# Altium schematic sheet Sheet1.SchDoc
size 840 x 594 mm; ЕСКД_Децимальний_номер: ДК41.468224.001; ЕСКД_Назва_пристрою: Контролер управління; ЕСКД_Назва_схеми_1: Схема електрична; ЕСКД_Назва_схеми_2: принципова; ЕСКД_Розробив: Білаш Б.О.; ЕСКД_Перевірив: Адаменко І.О.; ЕСКД_Затвердив: Антонюк О.І.; ЕСКД_Листів: 1; PageSetup: Record=PageOptions|CenterHorizontal=True|CenterVertical=True|PrintScale=0.98|XCorrection=1.00|YCorrection=1.00|PrintKind=1|BorderSize=5000000|LeftOffset=0|BottomOffset=0|Orientation=2|PaperLength=1000|PaperWidth=1000|Scale=100|PaperSource=15|PrintQuality=1200|MediaType=1|DitherType=10|PrintScaleMode=1|PaperKind=A3|PaperIndex=8; ЕСКД_Організація_1: КПІ ім. Ігоря Сікорського; ЕСКД_Організація_2: ФЕЛ, КЕОА, ДК-41; ЕСКД_Маштаб: 1:1; ЕСКД_Тема_1: Блок керування двигуном; ЕСКД_Тема_2: по положенню; ЕСКД_Децимальний_номер_Е3: ДК41.468224.001 Е3
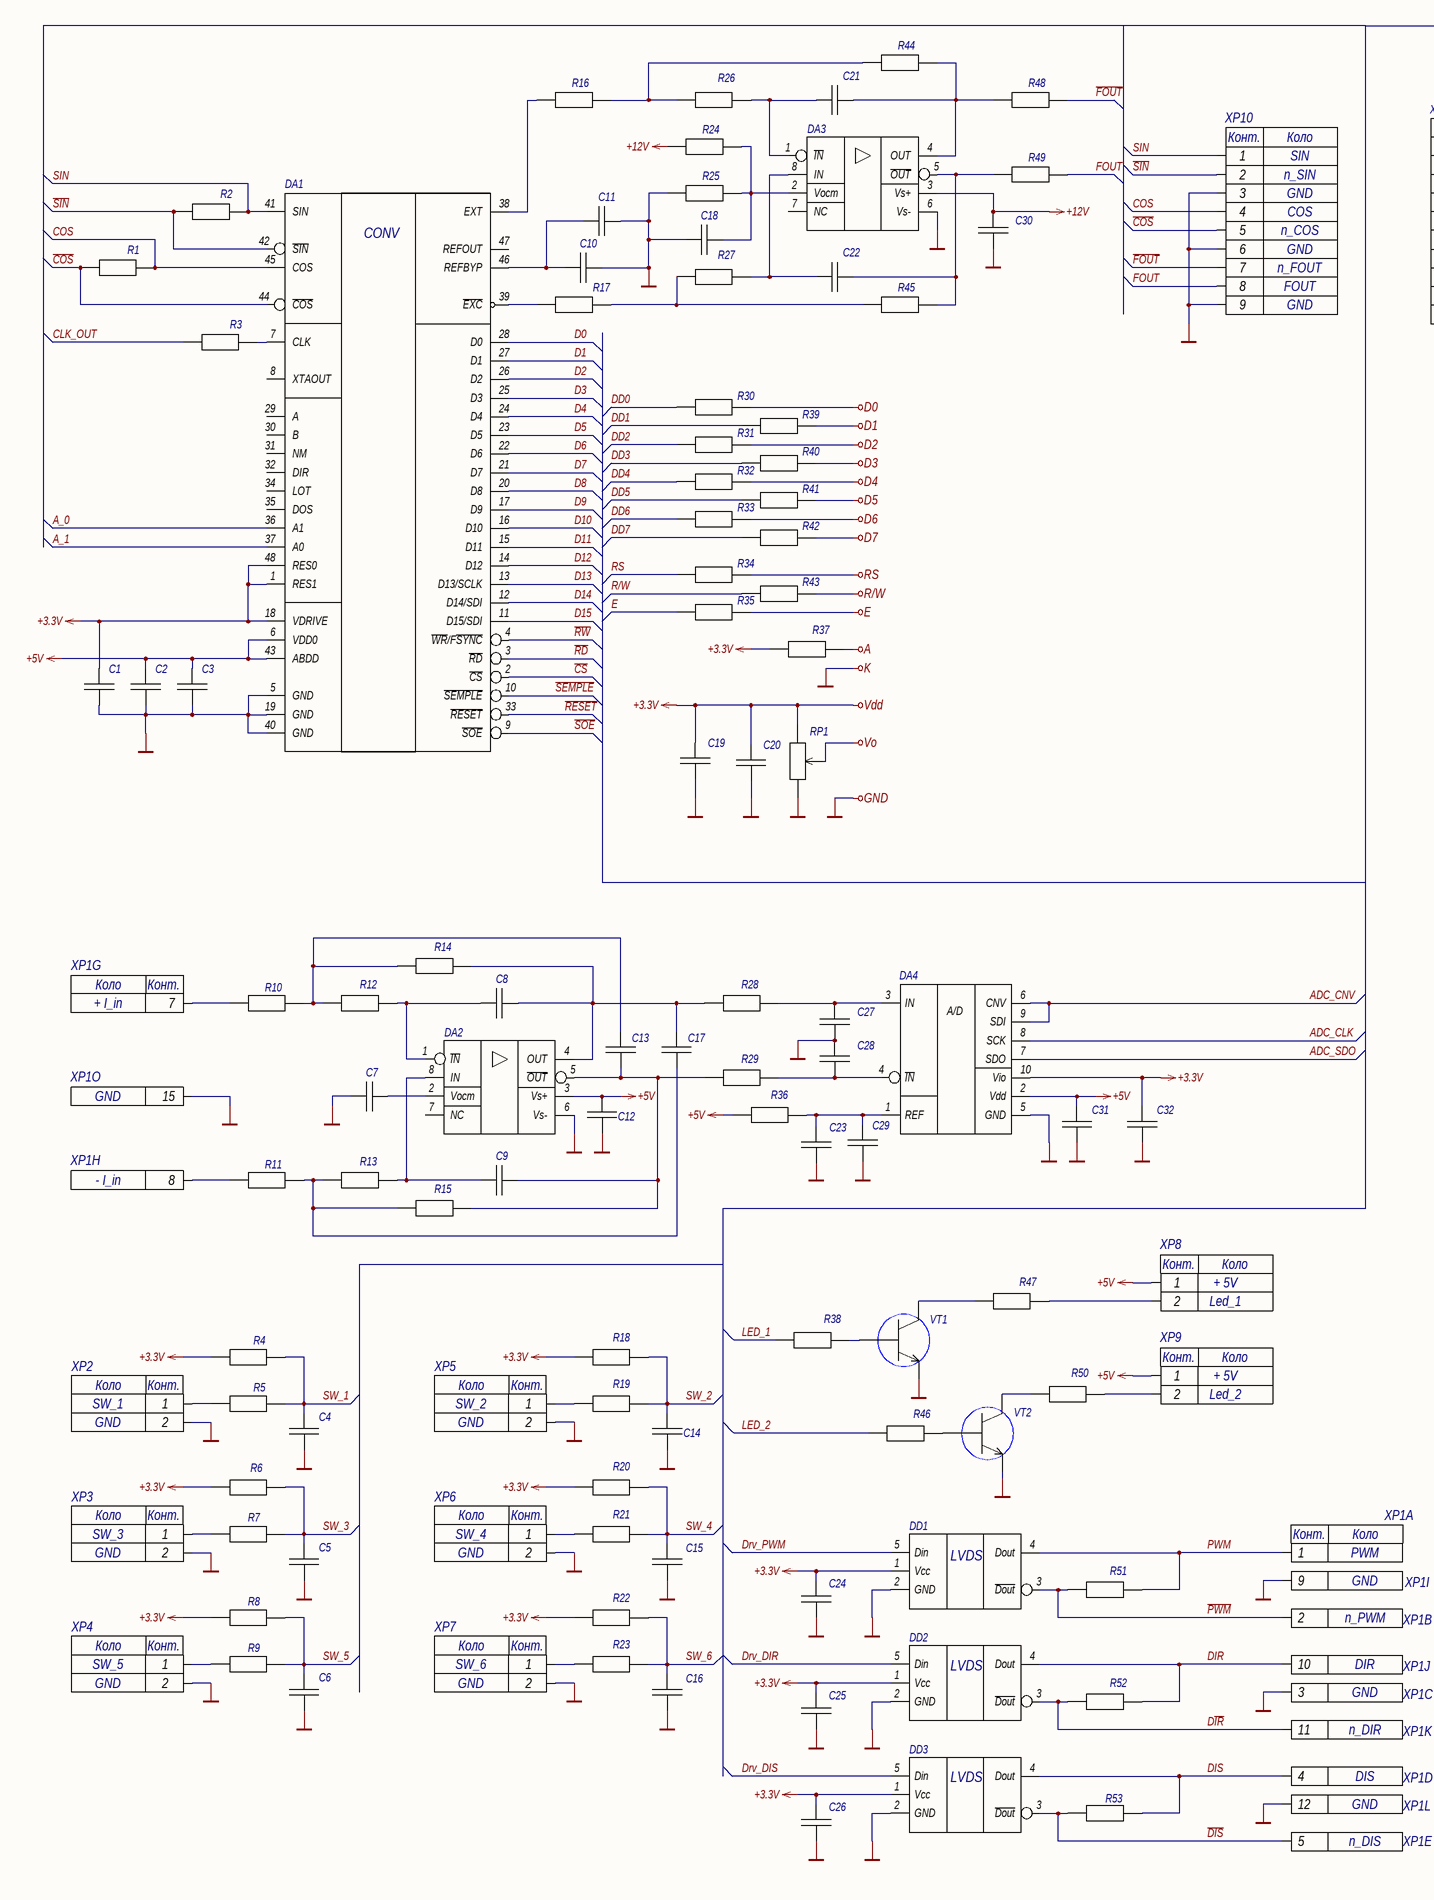
[diagram p0: Sheet1.SchDoc, left]
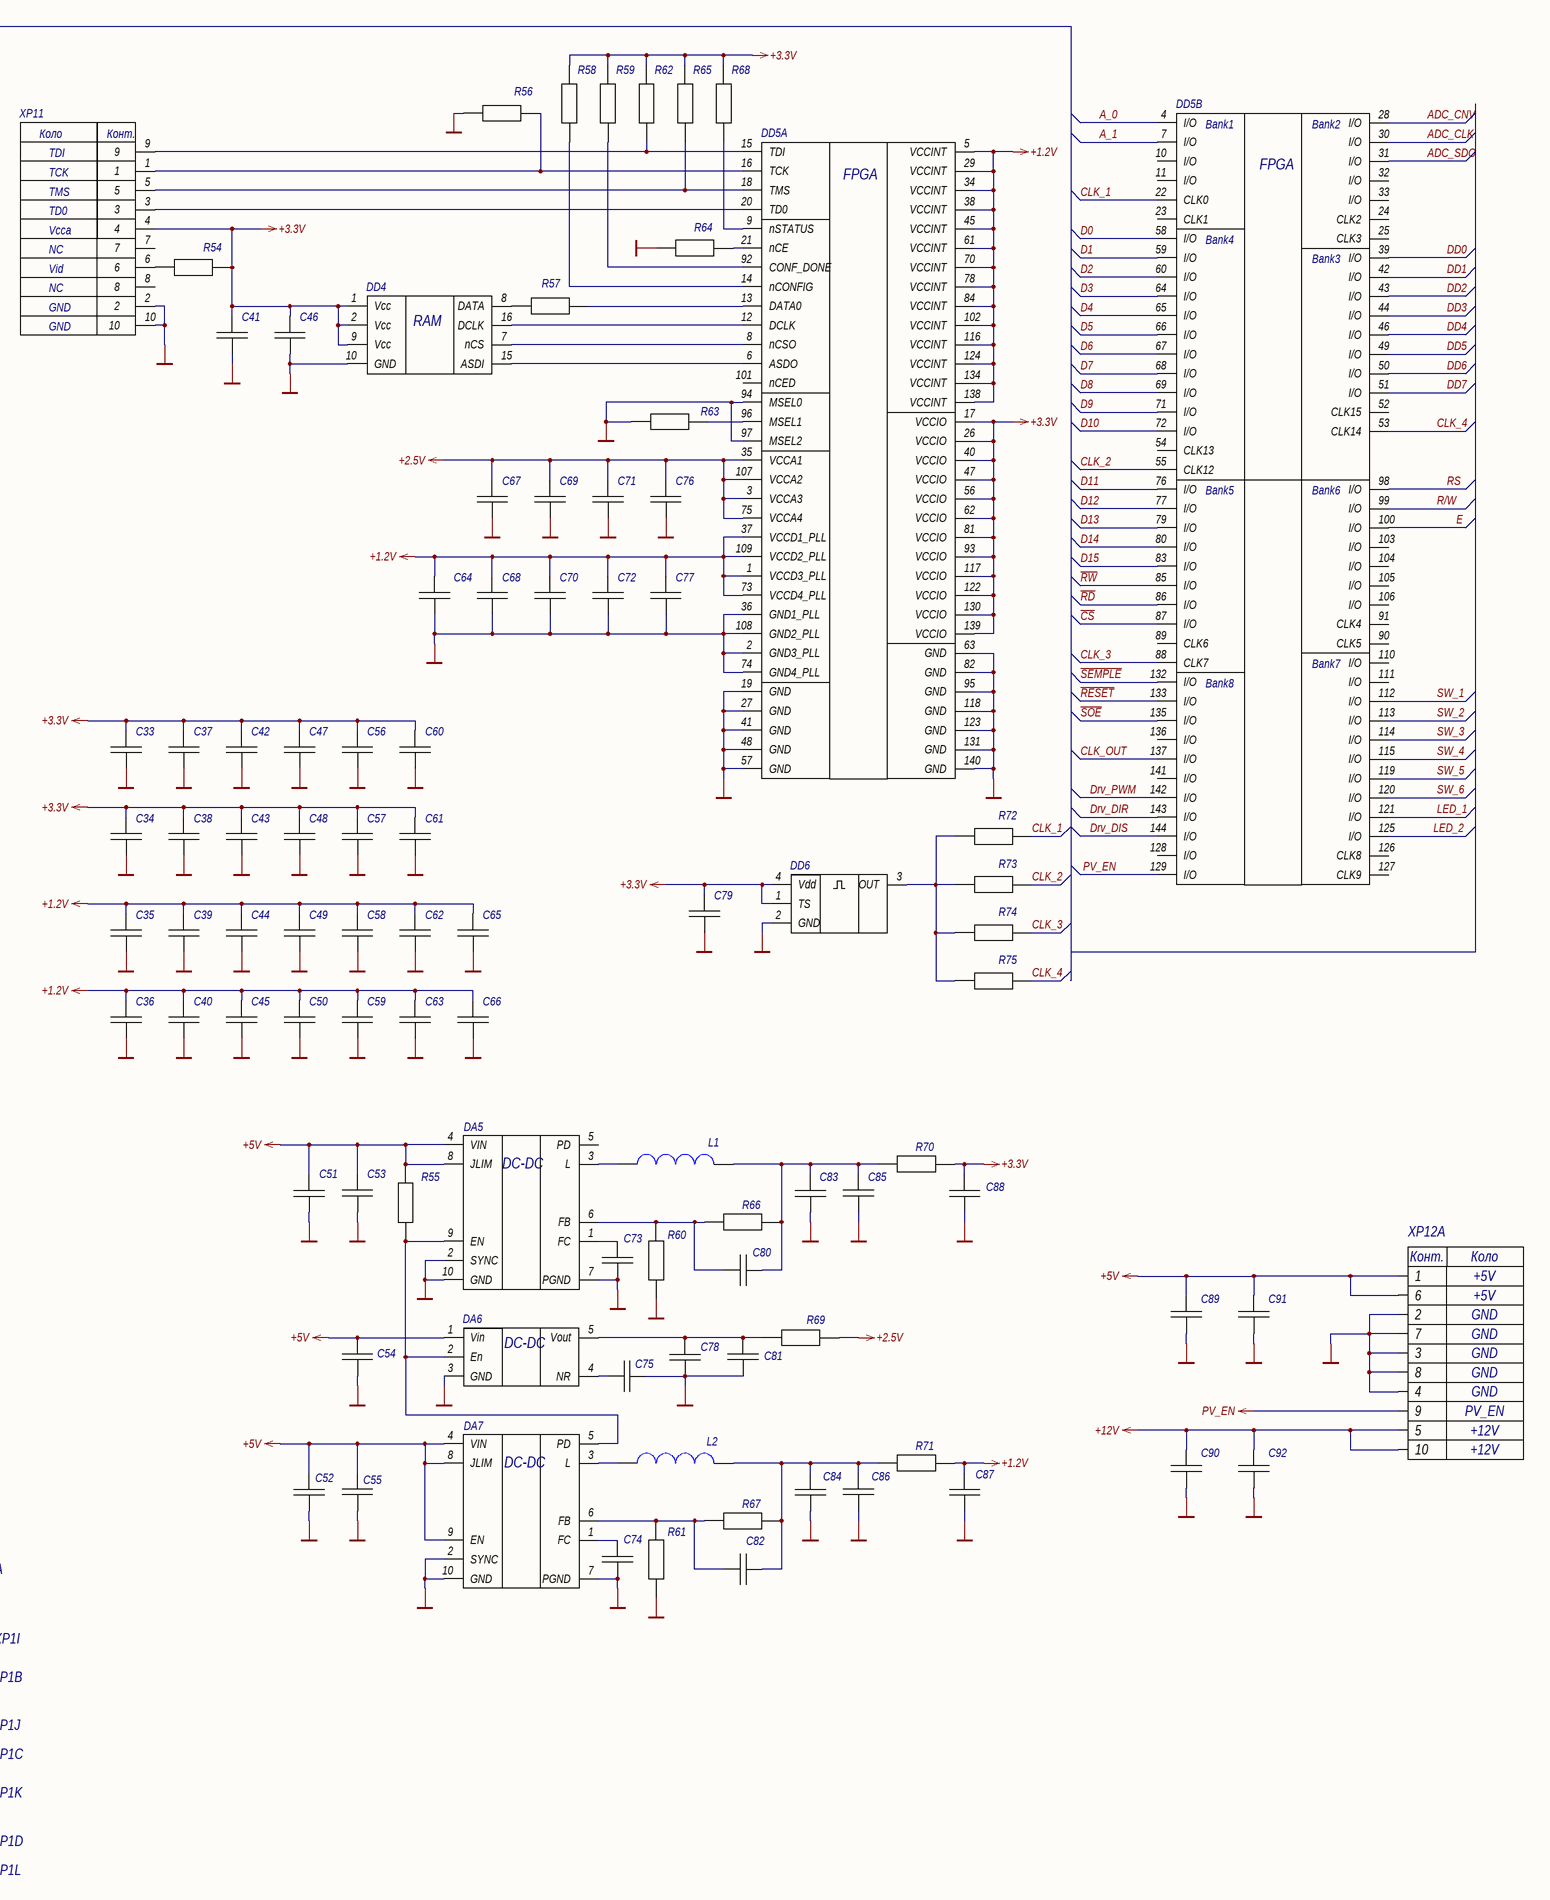
[diagram p1: Sheet1.SchDoc, right]

## Parts
(Parts that share a designator on the sheet are numbered #1, #2 ... from top to bottom, then left to right.)
?#1  (no value)
?#2  plata_1  (value not drawn)
?#3  plata  (value not drawn)
C1  0,1 мкФ  [C_0603]  (value not drawn)
C2  0,1 мкФ  [C_0603]  (value not drawn)
C3  0,1 мкФ  [C_0603]  (value not drawn)
C4  0,1 мкФ  [C_0603]  (value not drawn)
C5  0,1 мкФ  [C_0603]  (value not drawn)
C6  0,1 мкФ  [C_0603]  (value not drawn)
C7  0,1 мкФ  [C_0603]  (value not drawn)
C8  68 пФ  [C_0603]  (value not drawn)
C9  68 пФ  [C_0603]  (value not drawn)
C10  10 мкФ  [C_1206]  (value not drawn)
C11  0,1 мкФ  [C_0603]  (value not drawn)
C12  0,1 мкФ  [C_0603]  (value not drawn)
C13  68 пФ  [C_0603]  (value not drawn)
C14  0,1 мкФ  [C_0603]  (value not drawn)
C15  0,1 мкФ  [C_0603]  (value not drawn)
C16  0,1 мкФ  [C_0603]  (value not drawn)
C17  68 пФ  [C_0603]  (value not drawn)
C18  0,1 мкФ  [C_0603]  (value not drawn)
C19  0,1 мкФ  [C_0603]  (value not drawn)
C20  10 мкФ  [C_1206]  (value not drawn)
C21  68 пФ  [C_0603]  (value not drawn)
C22  68 пФ  [C_0603]  (value not drawn)
C23  10 мкФ  [C_1206]  (value not drawn)
C24  0,1 мкФ  [C_0603]  (value not drawn)
C25  0,1 мкФ  [C_0603]  (value not drawn)
C26  0,1 мкФ  [C_0603]  (value not drawn)
C27  1,8 нФ  [C_0603]  (value not drawn)
C28  1,8 нФ  [C_0603]  (value not drawn)
C29  0,1 мкФ  [C_0603]  (value not drawn)
C30  0,1 мкФ  [C_0603]  (value not drawn)
C31  0,1 мкФ  [C_0603]  (value not drawn)
C32  0,1 мкФ  [C_0603]  (value not drawn)
C33  0,1 мкФ  [C_0603]  (value not drawn)
C34  0,1 мкФ  [C_0603]  (value not drawn)
C35  0,1 мкФ  [C_0603]  (value not drawn)
C36  0,1 мкФ  [C_0603]  (value not drawn)
C37  0,1 мкФ  [C_0603]  (value not drawn)
C38  0,1 мкФ  [C_0603]  (value not drawn)
C39  0,1 мкФ  [C_0603]  (value not drawn)
C40  0,1 мкФ  [C_0603]  (value not drawn)
C41  0,1 мкФ  [C_0603]  (value not drawn)
C42  0,1 мкФ  [C_0603]  (value not drawn)
C43  0,1 мкФ  [C_0603]  (value not drawn)
C44  0,1 мкФ  [C_0603]  (value not drawn)
C45  0,1 мкФ  [C_0603]  (value not drawn)
C46  0,1 мкФ  [C_0603]  (value not drawn)
C47  0,1 мкФ  [C_0603]  (value not drawn)
C48  0,1 мкФ  [C_0603]  (value not drawn)
C49  0,1 мкФ  [C_0603]  (value not drawn)
C50  0,1 мкФ  [C_0603]  (value not drawn)
C51  10 мкФ  [C_1206]  (value not drawn)
C52  10 мкФ  [C_1206]  (value not drawn)
C53  0,1 мкФ  [C_0603]  (value not drawn)
C54  0,1 мкФ  [C_0603]  (value not drawn)
C55  0,1 мкФ  [C_0603]  (value not drawn)
C56  0,1 мкФ  [C_0603]  (value not drawn)
C57  0,1 мкФ  [C_0603]  (value not drawn)
C58  0,1 мкФ  [C_0603]  (value not drawn)
C59  0,1 мкФ  [C_0603]  (value not drawn)
C60  0,1 мкФ  [C_0603]  (value not drawn)
C61  0,1 мкФ  [C_0603]  (value not drawn)
C62  0,1 мкФ  [C_0603]  (value not drawn)
C63  0,1 мкФ  [C_0603]  (value not drawn)
C64  0,1 мкФ  [C_0603]  (value not drawn)
C65  0,1 мкФ  [C_0603]  (value not drawn)
C66  0,1 мкФ  [C_0603]  (value not drawn)
C67  0,1 мкФ  [C_0603]  (value not drawn)
C68  0,1 мкФ  [C_0603]  (value not drawn)
C69  0,1 мкФ  [C_0603]  (value not drawn)
C70  0,1 мкФ  [C_0603]  (value not drawn)
C71  0,1 мкФ  [C_0603]  (value not drawn)
C72  0,1 мкФ  [C_0603]  (value not drawn)
C73  0,1 мкФ  [C_0603]  (value not drawn)
C74  0,1 мкФ  [C_0603]  (value not drawn)
C75  0,1 мкФ  [C_0603]  (value not drawn)
C76  0,1 мкФ  [C_0603]  (value not drawn)
C77  0,1 мкФ  [C_0603]  (value not drawn)
C78  10 мкФ  [C_1206]  (value not drawn)
C79  0,1 мкФ  [C_0603]  (value not drawn)
C80  220 пФ  [C_0603]  (value not drawn)
C81  0,1 мкФ  [C_0603]  (value not drawn)
C82  220 пФ  [C_0603]  (value not drawn)
C83  10 мкФ  [C_1206]  (value not drawn)
C84  10 мкФ  [C_1206]  (value not drawn)
C85  0,1 мкФ  [C_0603]  (value not drawn)
C86  0,1 мкФ  [C_0603]  (value not drawn)
C87  10 мкФ  [C_1206]  (value not drawn)
C88  10 мкФ  [C_1206]  (value not drawn)
C89  10 мкФ  [C_1206]  (value not drawn)
C90  10 мкФ  [C_1206]  (value not drawn)
C91  0,1 мкФ  [C_0603]  (value not drawn)
C92  0,1 мкФ  [C_0603]  (value not drawn)
DA1  AD2S1210_QFP-48 0.5MM/WG9  [QFP-48 0.5MM/WG9]  (value not drawn)
DA2  THS4130IDGK (MSOP8)  [THS4130IDGK(MSOP8)]  (value not drawn)
DA3  THS4130IDGK (MSOP8)  [THS4130IDGK(MSOP8)]  (value not drawn)
DA4  AD7687BRMZ  [AD7687BRMZ]  (value not drawn)
DA5  TPS62000DGS_VSSOP10  [AD7687BRMZ]  (value not drawn)
DA6  TPS79325-Q1_SOT-23-5L  [SOT95P280X110-5N]  (value not drawn)
DA7  TPS62000DGS_VSSOP10  [AD7687BRMZ]  (value not drawn)
DD1  FIN1001M5X  [SOT95P280X110-5N]  (value not drawn)
DD2  FIN1001M5X  [SOT95P280X110-5N]  (value not drawn)
DD3  FIN1001M5X  [SOT95P280X110-5N]  (value not drawn)
DD4  EPCS16SI16N_SOIC-16 155 WIDE  [SOIC127P600X175-16N]  (value not drawn)
DD5  EP3C25E144I7_QFP-144 0.5MM/WG22  [QFP127P600-8N]  (value not drawn)  (parts A,B of 2)
DD6  ECS-3963_ECS-3963(5.2X3.2)  [ECS-3961]  (value not drawn)
L1  L_22mkH_1210R-223H-ND  [1210R_IND]  (value not drawn)
L2  L_22mkH_1210R-223H-ND  [1210R_IND]  (value not drawn)
R1  10 кОм  [R_0603]  (value not drawn)
R2  10 кОм  [R_0603]  (value not drawn)
R3  27 Ом  [R_0603]  (value not drawn)
R4  100 кОм  [R_0603]  (value not drawn)
R5  1 кОм  [R_0603]  (value not drawn)
R6  100 кОм  [R_0603]  (value not drawn)
R7  1 кОм  [R_0603]  (value not drawn)
R8  100 кОм  [R_0603]  (value not drawn)
R9  1 кОм  [R_0603]  (value not drawn)
R10  51 кОм  [R_0603]  (value not drawn)
R11  51 кОм  [R_0603]  (value not drawn)
R12  11,3 кОм  [R_0603]  (value not drawn)
R13  11,3 кОм  [R_0603]  (value not drawn)
R14  24,3 кОм  [R_0603]  (value not drawn)
R15  24,3 кОм  [R_0603]  (value not drawn)
R16  51 кОм  [R_0603]  (value not drawn)
R17  51 кОм  [R_0603]  (value not drawn)
R18  100 кОм  [R_0603]  (value not drawn)
R19  1 кОм  [R_0603]  (value not drawn)
R20  100 кОм  [R_0603]  (value not drawn)
R21  1 кОм  [R_0603]  (value not drawn)
R22  100 кОм  [R_0603]  (value not drawn)
R23  1 кОм  [R_0603]  (value not drawn)
R24  51 кОм  [R_0603]  (value not drawn)
R25  51 кОм  [R_0603]  (value not drawn)
R26  11,3 кОм  [R_0603]  (value not drawn)
R27  11,3 кОм  [R_0603]  (value not drawn)
R28  10k  [R_0603]  (value not drawn)
R29  27 Ом  [R_0603]  (value not drawn)
R30  27 Ом  [R_0603]  (value not drawn)
R31  27 Ом  [R_0603]  (value not drawn)
R32  27 Ом  [R_0603]  (value not drawn)
R33  27 Ом  [R_0603]  (value not drawn)
R34  27 Ом  [R_0603]  (value not drawn)
R35  27 Ом  [R_0603]  (value not drawn)
R36  27 Ом  [R_0603]  (value not drawn)
R37  27  [R_1206]  (value not drawn)
R38  47 Ом  [R_0603]  (value not drawn)
R39  27 Ом  [R_0603]  (value not drawn)
R40  27 Ом  [R_0603]  (value not drawn)
R41  27 Ом  [R_0603]  (value not drawn)
R42  27 Ом  [R_0603]  (value not drawn)
R43  27 Ом  [R_0603]  (value not drawn)
R44  24,3 кОм  [R_0603]  (value not drawn)
R45  24,3 кОм  [R_0603]  (value not drawn)
R46  47 Ом  [R_0603]  (value not drawn)
R47  47 Ом  [R_0603]  (value not drawn)
R48  27 Ом  [R_0603]  (value not drawn)
R49  27 Ом  [R_0603]  (value not drawn)
R50  47 Ом  [R_0603]  (value not drawn)
R51  100 Ом  [R_0603]  (value not drawn)
R52  100 Ом  [R_0603]  (value not drawn)
R53  100 Ом  [R_0603]  (value not drawn)
R54  27  [R_1206]  (value not drawn)
R55  47 кОм  [R_1206]  (value not drawn)
R56  10 кОм  [R_0603]  (value not drawn)
R57  27  [R_1206]  (value not drawn)
R58  10 кОм  [R_0603]  (value not drawn)
R59  10 кОм  [R_0603]  (value not drawn)
R60  15 кОм  [R_1206]  (value not drawn)
R61  100 кОм  [R_1206]  (value not drawn)
R62  10 кОм  [R_0603]  (value not drawn)
R63  10 кОм  [R_0603]  (value not drawn)
R64  10 кОм  [R_0603]  (value not drawn)
R65  10 кОм  [R_0603]  (value not drawn)
R66  95,3 кОм  [R_1206]  (value not drawn)
R67  165 кОм  [R_1206]  (value not drawn)
R68  10 кОм  [R_0603]  (value not drawn)
R69  0 Ом  [R_1206]  (value not drawn)
R70  0 Ом  [R_1206]  (value not drawn)
R71  0 Ом  [R_1206]  (value not drawn)
R72  27 Ом  [R_0603]  (value not drawn)
R73  27 Ом  [R_0603]  (value not drawn)
R74  27 Ом  [R_0603]  (value not drawn)
R75  27 Ом  [R_0603]  (value not drawn)
RP1  (no value)  [RES_TRIMMER_3361P-1-103GLF]
VT1  BC846B  [SOT95P245X110 3N]  (value not drawn)
VT2  BC846B  [SOT95P245X110 3N]  (value not drawn)
XP1  DB_15  [DSUB-15]  (value not drawn)  (parts A,B,C,D,E,G,H,I,J,K,L,O of 15)
XP2  M20-9770242  [B2B-XH-A]  (value not drawn)
XP3  M20-9770242  [B2B-XH-A]  (value not drawn)
XP4  M20-9770242  [B2B-XH-A]  (value not drawn)
XP5  M20-9770242  [B2B-XH-A]  (value not drawn)
XP6  M20-9770242  [B2B-XH-A]  (value not drawn)
XP7  M20-9770242  [B2B-XH-A]  (value not drawn)
XP8  M20-9770242  [B2B-XH-A]  (value not drawn)
XP9  M20-9770242  [B2B-XH-A]  (value not drawn)
XP10  A-DF 09 A/KG-T2S  [A-DF 09 A/KG-T2S]  (value not drawn)
XP11  KLS1-2-5  [KLS1-2-5]  (value not drawn)
XP12  M80-5101042  [M80-5100842]  (value not drawn)  (parts A,B,C,D,E,F,G,H,I,J of 10)

## Nets
+1.2V: C35.2 C36.2 C39.2 C40.2 C44.2 C45.2 C49.2 C50.2 C58.2 C59.2 C62.2 C63.2 C64.2 C65.2 C66.2 C68.2 C70.2 C72.2 C77.2 C87.2 DD5.1(VCCD3_PLL) DD5.5(VCCINT) DD5.29(VCCINT) DD5.34(VCCINT) DD5.37(VCCD1_PLL) DD5.38(VCCINT) DD5.45(VCCINT) DD5.61(VCCINT) DD5.70(VCCINT) DD5.73(VCCD4_PLL) DD5.78(VCCINT) DD5.84(VCCINT) DD5.102(VCCINT) DD5.109(VCCD2_PLL) DD5.116(VCCINT) DD5.124(VCCINT) DD5.134(VCCINT) DD5.138(VCCINT) R71.1
+2.5V: C67.2 C69.2 C71.2 C76.2 DD5.3(VCCA3) DD5.35(VCCA1) DD5.75(VCCA4) DD5.107(VCCA2) R69.1
+3.3V: C1.2 C19.2 C20.2 C24.1 C25.1 C26.1 C32.1 C33.2 C34.2 C37.2 C38.2 C41.2 C42.2 C43.2 C46.2 C47.2 C48.2 C56.2 C57.2 C60.2 C61.2 C79.2 C88.2 DA1.1(RES1) DA1.18(VDRIVE) DA1.48(RES0) DA4.10(Vio) DD1.1(Vcc) DD2.1(Vcc) DD3.1(Vcc) DD4.1(Vcc) DD4.2(Vcc) DD4.9(Vcc) DD5.17(VCCIO) DD5.26(VCCIO) DD5.40(VCCIO) DD5.47(VCCIO) DD5.56(VCCIO) DD5.62(VCCIO) DD5.81(VCCIO) DD5.93(VCCIO) DD5.117(VCCIO) DD5.122(VCCIO) DD5.130(VCCIO) DD5.139(VCCIO) DD6.1(TS) DD6.4(Vdd) R4.1 R6.1 R8.1 R18.1 R20.1 R22.1 R37.1 R54.1 R58.2 R59.2 R62.2 R65.2 R68.2 R70.1 RP1.2 XP11.4  [also labelled Vdd]
+5V: C2.2 C3.2 C12.1 C31.1 C51.2 C52.2 C53.1 C54.1 C55.1 C89.2 C91.1 DA1.6(VDD0) DA1.43(ABDD) DA2.3(Vs+) DA4.2(Vdd) DA5.4(VIN) DA5.8(JLIM) DA6.1(Vin) DA7.4(VIN) DA7.8(JLIM) DA7.9(EN) R36.1 R55.1 XP8.1 XP9.1 XP12.1 XP12.6
+12V: C30.1 C90.2 C92.1 DA3.3(Vs+) R24.1 XP12.5 XP12.10
A: R37.2
D0: DA1.28(D0) DD5.58(I/O) R30.2
D1: DA1.27(D1) DD5.59(I/O) R39.2
D2: DA1.26(D2) DD5.60(I/O) R31.2
D3: DA1.25(D3) DD5.64(I/O) R40.2
D4: DA1.24(D4) DD5.65(I/O) R32.2
D5: DA1.23(D5) DD5.66(I/O) R41.2
D6: DA1.22(D6) DD5.67(I/O) R33.2
D7: DA1.21(D7) DD5.68(I/O) R42.2
E: DD5.100(I/O) R35.1 R35.2
GND: C1.1 C2.1 C3.1 C4.2 C5.2 C6.2 C7.1 C10.1 C11.1 C12.2 C14.2 C15.2 C16.2 C18.2 C19.1 C20.1 C24.2 C25.2 C26.2 C27.2 C28.1 C29.2 C30.2 C31.2 C32.2 C33.1 C34.1 C35.1 C36.1 C37.1 C38.1 C39.1 C40.1 C41.1 C42.1 C43.1 C44.1 C45.1 C46.1 C47.1 C48.1 C49.1 C50.1 C51.1 C52.1 C53.2 C54.2 C55.2 C56.1 C57.1 C58.1 C59.1 C60.1 C61.1 C62.1 C63.1 C64.1 C65.1 C66.1 C67.1 C68.1 C69.1 C70.1 C71.1 C72.1 C73.2 C74.2 C75.1 C76.1 C77.1 C78.1 C79.1 C81.2 C83.1 C84.1 C85.2 C86.2 C87.1 C88.1 C89.1 C90.1 C91.2 C92.2 DA1.5(GND) DA1.19(GND) DA1.40(GND) DA2.6(Vs-) DA3.6(Vs-) DA4.5(GND) DA5.2(SYNC) DA5.7(PGND) DA5.10(GND) DA6.3(GND) DA7.2(SYNC) DA7.7(PGND) DA7.10(GND) DD1.2(GND) DD2.2(GND) DD3.2(GND) DD4.10(GND) DD5.2(GND3_PLL) DD5.19(GND) DD5.27(GND) DD5.36(GND1_PLL) DD5.41(GND) DD5.48(GND) DD5.57(GND) DD5.63(GND) DD5.74(GND4_PLL) DD5.82(GND) DD5.94(MSEL0) DD5.95(GND) DD5.97(MSEL2) DD5.108(GND2_PLL) DD5.118(GND) DD5.123(GND) DD5.131(GND) DD5.140(GND) DD6.2(GND) R25.1 R56.1 R60.2 R61.2 R63.1 R64.1 RP1.1 VT1.2 VT2.2 XP1.3 XP1.9 XP1.12 XP1.15 XP2.2 XP3.2 XP4.2 XP5.2 XP6.2 XP7.2 XP10.3 XP10.6 XP10.9 XP11.2 XP11.10 XP12.2 XP12.3 XP12.4 XP12.7 XP12.8  [also labelled K]
PV_EN: DD5.129(I/O) XP12.9
R/W: DD5.99(I/O) R43.1 R43.2
RS: DD5.98(I/O) R34.1 R34.2
Vo: RP1.3
A_0: DA1.36(A1) DD5.4(I/O)
A_1: DA1.37(A0) DD5.7(I/O)
ADC_CLK: DA4.8(SCK) DD5.30(I/O)
ADC_CNV: DA4.6(CNV) DA4.9(SDI) DD5.28(I/O)
ADC_SDO: DA4.7(SDO) DD5.31(I/O)
~{COS}: DA1.44(~{COS}) R1.2 XP10.5
~{CS}: DA1.2(~{CS}) DD5.87(I/O)
CLK_1: DD5.22(CLK0) R72.2
CLK_2: DD5.55(CLK12) R73.2
CLK_3: DD5.88(CLK7) R74.2
CLK_4: DD5.53(CLK14) R75.2
CLK_OUT: DD5.137(I/O) R3.1
COS: DA1.45(COS) R1.1 XP10.4
D8: DA1.20(D8) DD5.69(I/O)
D9: DA1.17(D9) DD5.71(I/O)
D10: DA1.16(D10) DD5.72(I/O)
D11: DA1.15(D11) DD5.76(I/O)
D12: DA1.14(D12) DD5.77(I/O)
D13: DA1.13(D13/SCLK) DD5.79(I/O)
D14: DA1.12(D14/SDI) DD5.80(I/O)
D15: DA1.11(D15/SDI) DD5.83(I/O)
~{DIS}: DD3.3(~{Dout}) R53.1 XP1.5
DD0: DD5.39(I/O) R30.1
DD1: DD5.42(I/O) R39.1
DD2: DD5.43(I/O) R31.1
DD3: DD5.44(I/O) R40.1
DD4: DD5.46(I/O) R32.1
DD5: DD5.49(I/O) R41.1
DD6: DD5.50(I/O) R33.1
DD7: DD5.51(I/O) R42.1
D~{I}~{R}: DD2.3(~{Dout}) R52.1 XP1.11
DIR: DD2.4(Dout) R52.2 XP1.10
DIS: DD3.4(Dout) R53.2 XP1.4
Drv_DIR: DD2.5(Din) DD5.143(I/O)
Drv_DIS: DD3.5(Din) DD5.144(I/O)
Drv_PWM: DD1.5(Din) DD5.142(I/O)
~{FOUT}: R48.2 XP10.7
FOUT: R49.2 XP10.8
LED_1: DD5.121(I/O) R38.1
LED_2: DD5.125(I/O) R46.1
~{PWM}: DD1.3(~{Dout}) R51.1 XP1.1(2)
PWM: DD1.4(Dout) R51.2 XP1.1
~{RD}: DA1.3(~{RD}) DD5.86(I/O)
~{RESET}: DA1.33(~{RESET}) DD5.133(I/O)
~{RW}: DA1.4(~{WR}/F~{SYNC}) DD5.85(I/O)
~{SEMPLE}: DA1.10(~{SEMPLE}) DD5.132(I/O)
~{SIN}: DA1.42(~{SIN}) R2.1 XP10.2
~{SOE}: DA1.9(~{SOE}) DD5.135(I/O)
SIN: DA1.41(SIN) R2.2 XP10.1
SW_1: C4.1 DD5.112(I/O) R4.2 R5.2
SW_2: C14.1 DD5.113(I/O) R18.2 R19.2
SW_3: C5.1 DD5.114(I/O) R6.2 R7.2
SW_4: C15.1 DD5.115(I/O) R20.2 R21.2
SW_5: C6.1 DD5.119(I/O) R8.2 R9.2
SW_6: C16.1 DD5.120(I/O) R22.2 R23.2
NetC7_2: C7.2 DA2.2(Vocm)
NetC8_1: C8.1 C17.1 DA2.4(OUT) R14.2 R28.1
NetC8_2: C8.2 DA2.1(~{IN}) R12.2
NetC9_1: C9.1 C13.2 DA2.5(~{OUT}) R15.1 R29.1
NetC9_2: C9.2 DA2.8(IN) R13.1
NetC10_2: C10.2 C11.2 DA1.46(REFBYP)
NetC13_1: C13.1 R10.2 R12.1 R14.1
NetC17_2: C17.2 R11.2 R13.2 R15.2
NetC18_1: C18.1 DA3.2(Vocm) R24.2 R25.2
NetC21_1: C21.1 DA3.4(OUT) R44.2 R48.1
NetC21_2: C21.2 DA3.1(~{IN}) R26.2
NetC22_1: C22.1 DA3.5(~{OUT}) R45.1 R49.1
NetC22_2: C22.2 DA3.8(IN) R27.2
NetC23_1: C23.1 C29.1 DA4.1(REF) R36.2
NetC27_1: C27.1 DA4.3(IN) R28.2
NetC28_2: C28.2 DA4.4(~{IN}) R29.2
NetC73_1: C73.1 DA5.1(FC)
NetC74_1: C74.1 DA7.1(FC)
NetC75_2: C75.2 DA6.4(NR)
NetC78_2: C78.2 C81.1 DA6.5(Vout) R69.2
NetC80_1: C80.1 DA5.6(FB) R60.1 R66.1
NetC80_2: C80.2 C83.2 C85.1 L1.2 R66.2 R70.2
NetC82_1: C82.1 DA7.6(FB) R61.1 R67.1
NetC82_2: C82.2 C84.2 C86.1 L2.2 R67.2 R71.2
NetDA1_7: DA1.7(CLK) R3.2
NetDA1_38: DA1.38(EXT) R16.1
NetDA1_39: DA1.39(~{EXC}) R17.1
NetDA5_3: DA5.3(L) L1.1
NetDA5_9: DA5.9(EN) DA6.2(En) DA7.5(PD) R55.2
NetDA7_3: DA7.3(L) L2.1
NetDD4_7: DD4.7(nCS) DD5.8(nCSO)
NetDD4_8: DD4.8(DATA) R57.1
NetDD4_15: DD4.15(ASDI) DD5.6(ASDO)
NetDD4_16: DD4.16(DCLK) DD5.12(DCLK)
NetDD5_9: DD5.9(nSTATUS) R68.1
NetDD5_13: DD5.13(DATA0) R57.2
NetDD5_14: DD5.14(nCONFIG) R58.1
NetDD5_15: DD5.15(TDI) R62.1 XP11.9
NetDD5_16: DD5.16(TCK) R56.2 XP11.1
NetDD5_18: DD5.18(TMS) R65.1 XP11.5
NetDD5_20: DD5.20(TD0) XP11.3
NetDD5_21: DD5.21(nCE) R64.2
NetDD5_92: DD5.92(CONF_DONE) R59.1
NetDD5_96: DD5.96(MSEL1) R63.2
NetDD6_3: DD6.3(OUT) R72.1 R73.1 R74.1 R75.1
NetR5_1: R5.1 XP2.1
NetR7_1: R7.1 XP3.1
NetR9_1: R9.1 XP4.1
NetR10_1: R10.1 XP1.7
NetR11_1: R11.1 XP1.8
NetR16_2: R16.2 R26.1 R44.1
NetR17_2: R17.2 R27.1 R45.2
NetR19_1: R19.1 XP5.1
NetR21_1: R21.1 XP6.1
NetR23_1: R23.1 XP7.1
NetR38_2: R38.2 VT1.1
NetR46_2: R46.2 VT2.1
NetR47_1: R47.1 VT1.3
NetR47_2: R47.2 XP8.2
NetR50_1: R50.1 VT2.3
NetR50_2: R50.2 XP9.2
NetR54_2: R54.2 XP11.6

Not connected (* = marked no-connect by the designer): C23 2; DA1 8(XTAOUT) 29(A) 30(B) 31(NM) 32(DIR) 34(LOT) 35(DOS) 47(REFOUT); DA2 7(NC); DA3 7(NC); DA5 5(PD); DD5 10(I/O) 11(I/O) 23(CLK1) 24(CLK2) 25(CLK3) 32(I/O) 33(I/O) 52(CLK15) 54(CLK13) 89(CLK6) 90(CLK5) 91(CLK4) 101(nCED) 103(I/O) 104(I/O) 105(I/O) 106(I/O) 110(I/O) 111(I/O) 126(CLK8) 127(CLK9) 128(I/O) 136(I/O) 141(I/O); XP11 7 8

## Notes on the sheet
- SIN
- n_SIN
- (near DD5) FPGA
- COS
- n_COS
- GND
- (near DA1) CONV
- n_FOUT
- FOUT
- (near DD4) RAM
- Коло
- (near XP1) Конт.
- + I_in
- (near DA5) DC-DC
- - I_in
- (near XP12) Конт.
- +5V
- Led_1
- + 5V
- (near DA6) DC-DC
- PV_EN
- SW_1
- SW_2
- Led_2
- +12V
- (near DA7) DC-DC
- SW_3
- SW_4
- PWM
- (near DD1) LVDS
- n_PWM
- SW_5
- SW_6
- (near DD2) LVDS
- DIR
- n_DIR
- (near DD3) LVDS
- DIS
- n_DIS
- Labels drawn without touching a wire or pin: GND
- Зм.
- Лист
- № докум.
- Підп.
- Дата
- Літ.
- Маса
- Маштаб
- Розроб.
- Перев.
- Аркуш
- Аркушів
- Н.контр.
- Затв.
- Формат А1
- (in symbol A-DF 09 A/KG-T2S) Конт.; Коло
- (in symbol AD7687BRMZ) A/D
- (in symbol EP3C25E144I7_QFP-144 0.5MM/WG22, part B) Bank1; Bank2; Bank4; Bank3; Bank5; Bank6; Bank7; Bank8
- (in symbol KLS1-2-5) Коло; Конт.; TDI; TCK; TMS; TD0; Vcca; NC; Vid; GND
- (in symbol M20-9770242) Конт.; Коло

## Library data of the parts
?#1 ?#3 = plata: Group_Specification: 4; Name: Плата друкована
?#2 = plata_1: Group_Specification: 7; Name: Лак
C1-C9 C11-C19 C21 C22 C24-C50 C53-C77 C79-C82 C85 C86 C91 C92 = C_0.1mkF_0603: Manufacturer: Yageo; Tolerance: 5%; Temp_Coef: X7R; Voltage: 50 В; Package: C-0603
  C1-C7 C11 C12 C14-C16 C18 C19 C24-C26 C29-C50 C53-C77 C79 C81 C85 C86 C91 C92: Value: 0,1 мкФ
  C8 C9 C13 C17 C21 C22: Value: 68 пФ
  C27 C28: Value: 1,8 нФ
  C80 C82: Value: 220 пФ
C10 C20 C23 C51 C52 C78 C83 C84 C87-C90 = C_10mkF_1206: Manufacturer: Yageo; Temp_Coef: X7R; Voltage: 50 В; Tolerance: 5%; Value: 10 мкФ; Package: C-1206
DA1 = AD2S1210_QFP-48 0.5MM/WG9: Manufacturer: Analog Devices; Case: QFP-48 0.5MM/WG9; Name: AD2S1210
DA2 DA3 = THS4130IDGK (MSOP8): Manufacturer: Texas Instruments; Name: THS4130IDGK
DA4 = AD7687BRMZ: Manufacturer: Analog Devices; Name: AD7687BRMZ
DA5 DA7 = TPS62000DGS_VSSOP10: Manufacturer: Texas Instruments; Name: TPS62000DGS
DA6 = TPS79325-Q1_SOT-23-5L: Manufacturer: Texas Instruments; Name: TPS79325
DD1-DD3 = FIN1001M5X: Manufacturer: ON Semiconductor; Name: FIN1001M5X
DD4 = EPCS16SI16N_SOIC-16 155 WIDE: Manufacturer: Altera; Name: EPCS16SI16N
DD5 = EP3C25E144I7_QFP-144 0.5MM/WG22: Manufacturer: Altera; Name: EP3C25E144I7
DD6 = ECS-3963_ECS-3963(5.2X3.2): Manufacturer: ECS Inc.; Name: ECS-3963
L1 L2 = L_22mkH_1210R-223H-ND: Manufacturer: Murata Manufacturing; Name: L-1210 22 мкГн 223H-ND
R1-R27 R56 R58 R59 R62-R65 R68 R72-R75 = R_100_0603: Manufacturer: Yageo; Tolerance: 1%; Power: 0,125 Вт; Package: R-0603
  R1 R2 R56 R58 R59 R62-R65 R68: Value: 10 кОм
  R3 R72-R75: Value: 27 Ом
  R4 R6 R8 R18 R20 R22: Value: 100 кОм
  R5 R7 R9 R19 R21 R23: Value: 1 кОм
  R10 R11 R16 R17 R24 R25: Value: 51 кОм
  R12 R13 R26 R27: Value: 11,3 кОм
  R14 R15: Value: 24,3 кОм
R28-R36 R38-R53 = R_10k_0603: Manufacturer: Yageo; Tolerance: 1%; Power: 0,125 Вт; Package: R-0603
  R28: Value: 10k
  R29-R36 R39-R43 R48 R49: Value: 27 Ом
  R38 R46 R47 R50: Value: 47 Ом
  R44 R45: Value: 24,3 кОм
  R51-R53: Value: 100 Ом
R37 R54 R55 R57 R60 R61 R66 R67 R69-R71 = R_10_1206: Manufacturer: Yageo; Tolerance: 1%; Power: 0,125 Вт; Package: R-1206
  R37 R54 R57: Value: 27
  R55: Value: 47 кОм
  R60: Value: 15 кОм
  R61: Value: 100 кОм
  R66: Value: 95,3 кОм
  R67: Value: 165 кОм
  R69-R71: Value: 0 Ом
RP1 = R_10k_RES_TRIMMER: R_10k_RES_TRIMMER_3361P-1-103GLF; Manufacturer: BOURNS; Name: 3361P-1-103GLF
VT1 VT2 = BC846B: Manufacturer: ON Semiconductor; Name: BC846B
XP1 = DB_15: Manufacturer: AMP Connectors; Name: 5747841-2
XP10 = A-DF 09 A/KG-T2S: Manufacturer: Assmann WSW Components; Name: A-DF 09 A/KG-T2S
XP12 = M80-5101042: Manufacturer: Harwin Inc.; Name: M80-5101042